# EasyEDA Pro project ProPrj_蓝牙遥控器.epro

# Schematic Schematic1
Board Name: Board1; Create Date: 2025-03-08; Page Name: P1; Project Name: 蓝牙遥控器; Schematic Name: Schematic1; Update Date: 2025-03-08; Company: 嘉立创EDA; Drawed: 李子晞; Page Size: A4; Version: V1.0
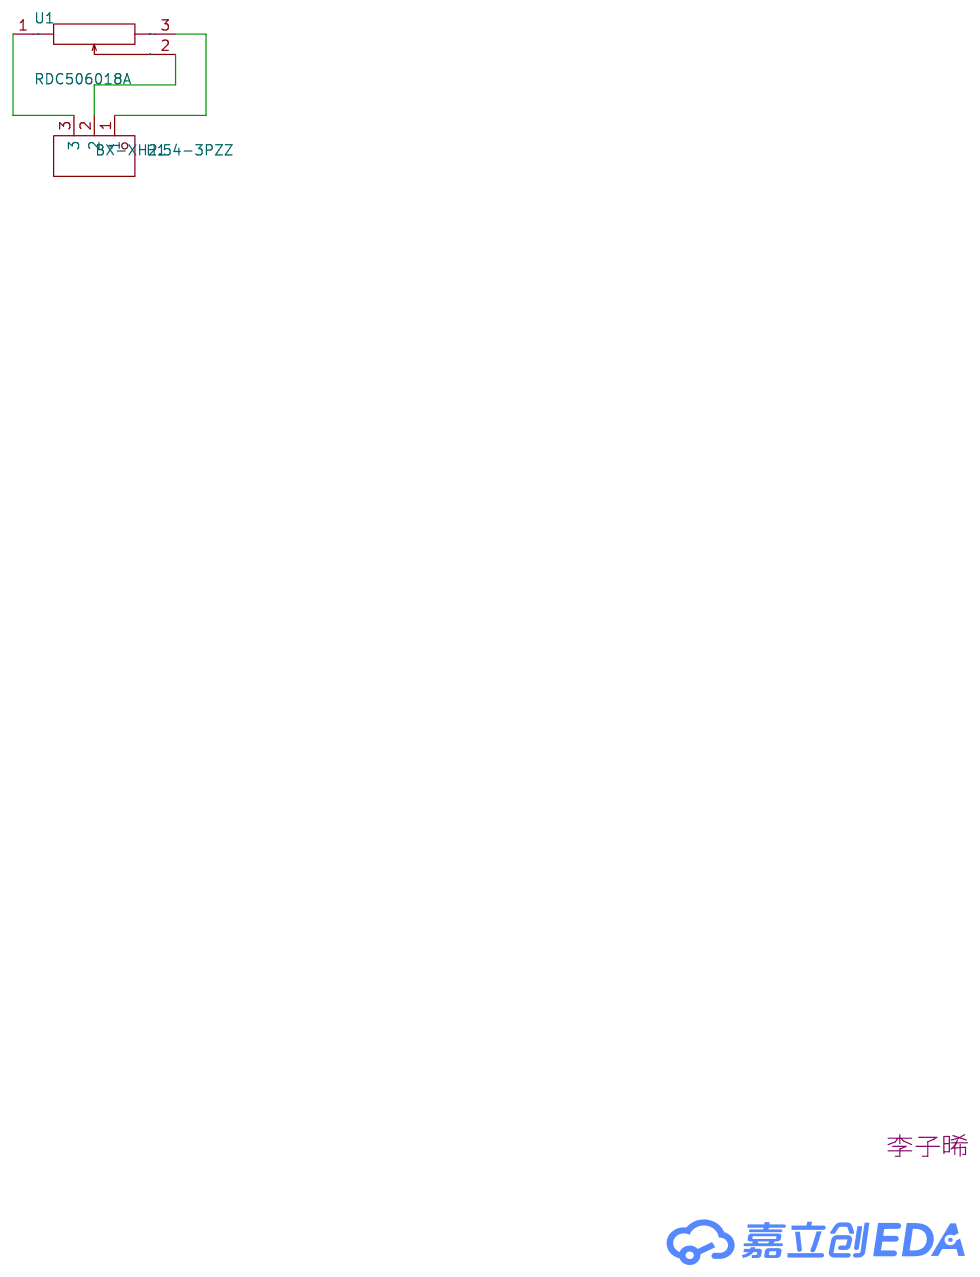
[diagram p0: schematic sheet]

## Parts
H1  BX-XH2.54-3PZZ  [CONN-TH_3P-P2.50_BX-XH2.54-3PZZ]
U1  RDC506018A  [SENSOR-SMD_RDC506018A]

## Library data of the parts
H1 = BX-XH2.54-3PZZ: 插针结构:1x3P;间距:2.5mm;安装方式:直插;参考系列:XH;总PIN数:3P;排数:1;每排PIN数:3;行距:-;额定电流:3A;触头材质:黄铜;触头镀层:锡;工作温度:-25℃~+85℃;; LCSC Part Name: 1x3P 间距:2.5mm 直插 系列:XH; Supplier Part: C18077834; Manufacturer: Bossie(博锡); Supplier Footprint: 插件,P=2.54mm; JLCPCB Part Class: Extended Part; Datasheet: https://atta.szlcsc.com/upload/public/pdf/source/20231017/BF89167887E1F965B2791D14EC788A09.pdf; Supplier: LCSC; Pins Structure: 1x3P; Pitch: 2.5mm; Mounting Type: 直插; Reference Series: XH; Number of Pins: 3P; Number of Rows: 1; Number of PINs Per Row: 3; Current Rating: 3A; Contact Material: 黄铜; Contact Plating: 锡; Operating Temperature: -25℃~+85℃; Voltage Rating: 250V; Plastic Material: PA66; Flame Retardant Rating: UL94V-0; Color: 白色; Z-Height of the Board: 7mm; X-Length of Bottom Edge on Board (Spacing Line): 10mm; Y-Width of Bottom Edge on Board: 5.9mm
U1 = RDC506018A: 额定电压5V DC,动作寿命100万次，总电阻值10kΩ，使用温度范围-40℃ to＋120℃，线性保证范围320°，线性±2%，可满足所有位置检测需要的旋转型传感器; Supplier Part: C388852; Manufacturer: ALPSALPINE(阿尔卑斯阿尔派); Supplier Footprint: SMD-4P,11x14.9mm; JLCPCB Part Class: 扩展库; Datasheet: https://atta.szlcsc.com/upload/public/pdf/source/20190429/C388852_87FA130E6FFB9C10E6A2BC328307F5A8.pdf; Supplier: LCSC

## Nets
$1N185: H1.3 U1.1(1T)
$1N190: H1.2 U1.2(2T)
$1N197: H1.1 U1.3(3T)

# Schematic Schematic2
Board Name: Board2; Create Date: 2025-03-08; Page Name: P1; Project Name: 蓝牙遥控器; Schematic Name: Schematic2; Update Date: 2025-03-09; Company: 嘉立创EDA; Drawed: 李子晞; Page Size: A4; Version: V1.0
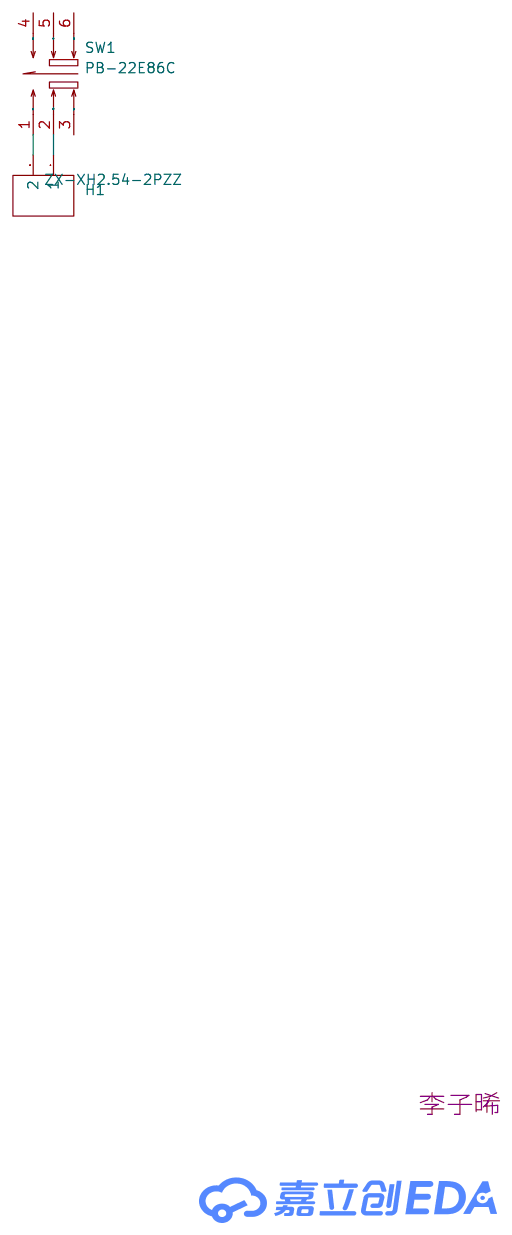
[diagram p1: schematic sheet]

## Parts
H1  ZX-XH2.54-2PZZ  [CONN-TH_2P-P2.50_HX25003-2A]
SW1  PB-22E86C  [SW-TH_6P-L8.45-W8.45-P2.50-LS5.5-BL]

## Library data of the parts
H1 = ZX-XH2.54-2PZZ: 插针结构:1x2P;间距:2.5mm;安装方式:直插;参考系列:XH;总PIN数:2P;排数:1;每排PIN数:2;行距:-;额定电流:3A;触头材质:黄铜;触头镀层:锡;工作温度范围:-25℃~+85℃;; LCSC Part Name: 1x2P 间距:2.5mm 直插 系列:XH; Supplier Part: C7429632; Manufacturer: Megastar(兆星); Supplier Footprint: 插件,P=2.5mm; JLCPCB Part Class: Extended Part; Datasheet: https://atta.szlcsc.com/upload/public/pdf/source/20230619/19BA6947230AA44A04D3EDD65E618FD0.pdf; Supplier: LCSC; Pins Structure: 1x2P; Pitch: 2.5mm; Mounting Type: 直插; Reference Series: XH; Number of Pins: 2P; Number of Rows: 1; Number of PINs Per Row: 2; Rated Current: 3A; Contact Material: 黄铜; Contact Plating: 锡; Operating Temperature: -25℃~+85℃; Rated Voltage (Max): 250V; Plastic Material: PA66; Flame Retardant Rating: UL94V-0; Color: 白色; Z-Height of the Board: 7mm; X-Length of Bottom Edge on Board (Spacing Line): 7.5mm; Y-Width of Bottom Edge on Board: 5.9mm
SW1 = PB-22E86C: 电路结构:双刀双掷;自锁/无锁:无锁;安装方式:直插;触点电流:500mA;额定电压 (AC):-;额定电压 (DC):30V;带灯:-;作用力:-;机械寿命:10万次;; LCSC Part Name: 8.5无锁按键开关; Supplier Part: C2848957; Manufacturer: G-Switch(品赞); Supplier Footprint: 插件; JLCPCB Part Class: 扩展库; Datasheet: https://atta.szlcsc.com/upload/public/pdf/source/20241029/FCE4AA5CBBB7A8CBC33D904DEAD1680D.pdf; Supplier: LCSC; Circuit: 双刀双掷; Self Lock / No Lock: 无锁; Actuator Style: 矩形柱塞; Mounting Style: 直插; Contact Current: 500mA; Voltage Rating (DC): 30V; Insulation Resistance: 100MΩ; Actuator/Cap Color: 黑色; Pin Style: PC引脚; Operating Temperature: -25℃~+65℃; Mechanical Life: 10万次

## Nets
$1N364: H1.2 SW1.1(BASE)
$1N367: H1.1 SW1.2(TERMINAL)

Not connected (* = marked no-connect by the designer): SW1 3(SPRING) 4(CONTACT) 5(STEM) 6(COVER)

# Schematic Schematic3
Board Name: 自定义控制器主控板; Create Date: 2025-03-10; Page Name: P1; Project Name: 蓝牙遥控器_开源; Schematic Name: Schematic3; Update Date: 2025-03-13; Company: 嘉立创EDA; Drawed: 李子晞; Page Size: A4; Version: V1.0
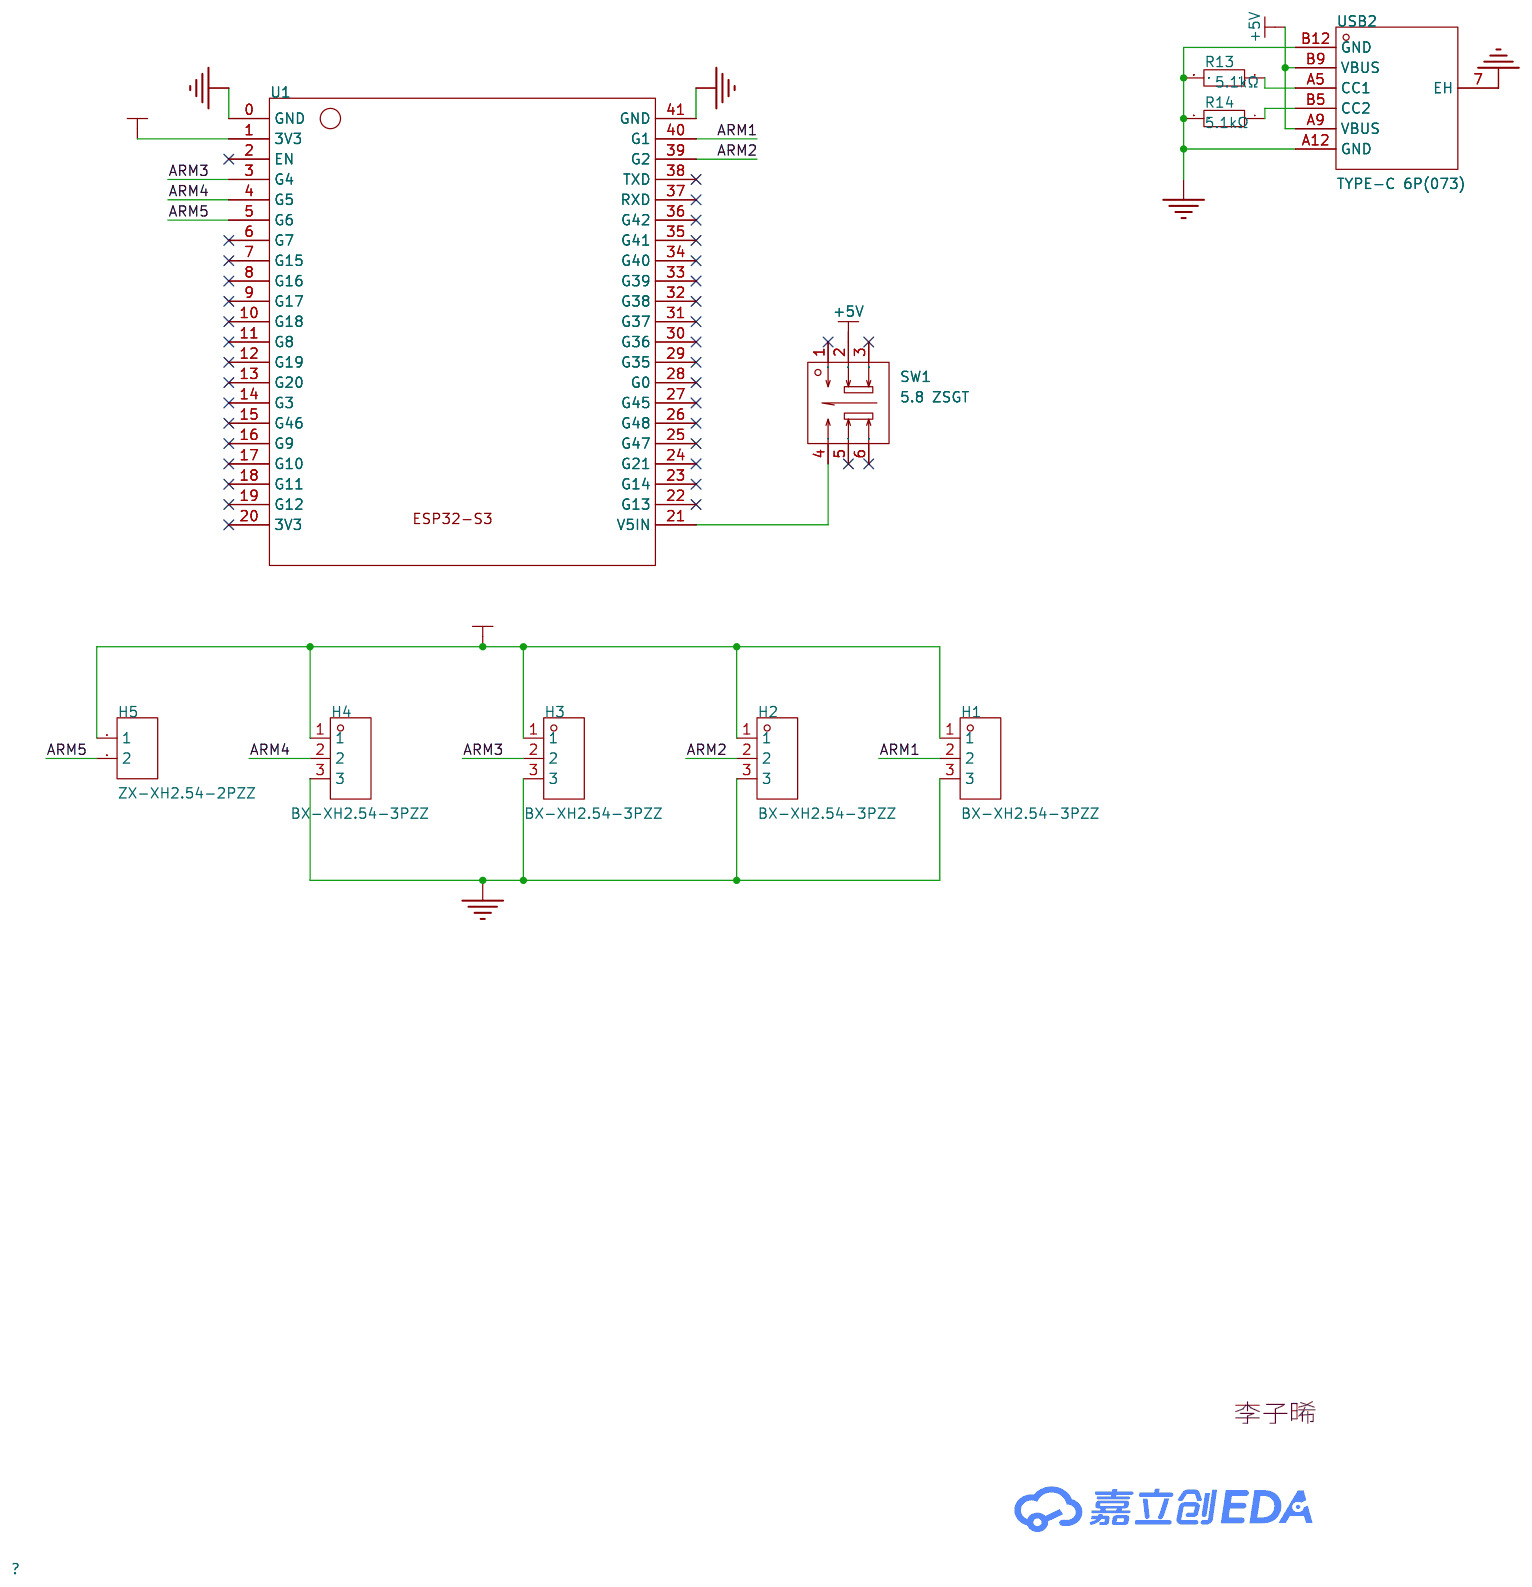
[diagram p2: schematic sheet]

## Parts
H1  BX-XH2.54-3PZZ  [CONN-TH_3P-P2.50_BX-XH2.54-3PZZ]
H2  BX-XH2.54-3PZZ  [CONN-TH_3P-P2.50_BX-XH2.54-3PZZ]
H3  BX-XH2.54-3PZZ  [CONN-TH_3P-P2.50_BX-XH2.54-3PZZ]
H4  BX-XH2.54-3PZZ  [CONN-TH_3P-P2.50_BX-XH2.54-3PZZ]
H5  ZX-XH2.54-2PZZ  [CONN-TH_2P-P2.50_HX25003-2A]
R13  5.1kΩ  [R0603]
R14  5.1kΩ  [R0603]
SW1  5.8 ZSGT  [SW-TH_5.8ZSGT]
U1  -  [ESP32-S3]
USB2  TYPE-C 6P(073)  [TYPE-C-SMD_TYPE-C-6P_5]

## Library data of the parts
H1-H4 = BX-XH2.54-3PZZ: 插针结构:1x3P;间距:2.5mm;安装方式:直插;参考系列:XH;总PIN数:3P;排数:1;每排PIN数:3;行距:-;额定电流:3A;触头材质:黄铜;触头镀层:锡;工作温度:-25℃~+85℃;; LCSC Part Name: 1x3P 间距:2.5mm 直插 系列:XH; Supplier Part: C18077834; Manufacturer: Bossie(博锡); Supplier Footprint: 插件,P=2.54mm; JLCPCB Part Class: Extended Part; Datasheet: https://atta.szlcsc.com/upload/public/pdf/source/20231017/BF89167887E1F965B2791D14EC788A09.pdf; Supplier: LCSC; Pins Structure: 1x3P; Pitch: 2.5mm; Mounting Type: 直插; Reference Series: XH; Number of Pins: 3P; Number of Rows: 1; Number of PINs Per Row: 3; Current Rating: 3A; Contact Material: 黄铜; Contact Plating: 锡; Operating Temperature: -25℃~+85℃; Voltage Rating: 250V; Plastic Material: PA66; Flame Retardant Rating: UL94V-0; Color: 白色; Z-Height of the Board: 7mm; X-Length of Bottom Edge on Board (Spacing Line): 10mm; Y-Width of Bottom Edge on Board: 5.9mm
H5 = ZX-XH2.54-2PZZ: 插针结构:1x2P;间距:2.5mm;安装方式:直插;参考系列:XH;总PIN数:2P;排数:1;每排PIN数:2;行距:-;额定电流:3A;触头材质:黄铜;触头镀层:锡;工作温度范围:-25℃~+85℃;; LCSC Part Name: 1x2P 间距:2.5mm 直插 系列:XH; Supplier Part: C7429632; Manufacturer: Megastar(兆星); Supplier Footprint: 插件,P=2.5mm; JLCPCB Part Class: Extended Part; Datasheet: https://atta.szlcsc.com/upload/public/pdf/source/20230619/19BA6947230AA44A04D3EDD65E618FD0.pdf; Supplier: LCSC; Pins Structure: 1x2P; Pitch: 2.5mm; Mounting Type: 直插; Reference Series: XH; Number of Pins: 2P; Number of Rows: 1; Number of PINs Per Row: 2; Rated Current: 3A; Contact Material: 黄铜; Contact Plating: 锡; Operating Temperature: -25℃~+85℃; Rated Voltage (Max): 250V; Plastic Material: PA66; Flame Retardant Rating: UL94V-0; Color: 白色; Z-Height of the Board: 7mm; X-Length of Bottom Edge on Board (Spacing Line): 7.5mm; Y-Width of Bottom Edge on Board: 5.9mm
R13 R14 = 0603WAF5101T5E: 电阻类型:厚膜电阻;阻值:5.1kΩ;精度:±1%;功率:100mW;最大工作电压:75V;温度系数:±100ppm/℃;; LCSC Part Name: 5.1kΩ ±1% 100mW 厚膜电阻; Supplier Part: C23186; Manufacturer: UNI-ROYAL(厚声); Supplier Footprint: 0603; JLCPCB Part Class: Basic Part; Datasheet: https://atta.szlcsc.com/upload/public/pdf/source/20200306/C422600_1E6D84923E4A46A82E41ADD87F860B5C.pdf; Supplier: LCSC; Type: 厚膜电阻; Tolerance: ±1%; Power(Watts): 100mW; Overload Voltage (Max): 75V; Temperature Coefficient: ±100ppm/℃; Operating Temperature Range: -55℃~+155℃
SW1 = 5.8 ZSGT: 电路结构:双刀双掷;自锁/无锁:自锁;安装方式:直插;触点电流:110mA;额定电压 (DC):30V;带灯:不带;作用力:1.5N;机械寿命:10万次;; LCSC Part Name: 5.8*5.8有头/高头 带锁/自锁开关 泡泡机开关; Supplier Part: C2681587; Manufacturer: SHOU HAN(首韩); Supplier Footprint: 插件; JLCPCB Part Class: 扩展库; Datasheet: https://atta.szlcsc.com/upload/public/pdf/source/20210107/C2681587_CDDDDA4A1C7AC9FEB01815B75893A6BA.pdf; Supplier: LCSC; Circuit: 双刀双掷; Self Lock / No Lock: 自锁; Actuator Style: 方形按钮; Mounting Style: 直插; Contact Current: 110mA; Voltage Rating (DC): 30V; Insulation Resistance: 100MΩ; Actuator/Cap Color: 白色; With Lamp: 不带; Pin Style: PC引脚; Operating Force: 1.5N; Operating Temperature: -10℃~+70℃; Mechanical Life: 10万次
U1 = ESP32S3: ESP32-S3 DevKitC-1-N16R8模块; Height: 14mm
USB2 = TYPE-C 6P(073): 连接器类型:Type-C;标准:USB 3.1;公母:母;安装方式:卧贴;触点数量:6P;端口数量:1;额定电流 - 电源:3A;工作温度范围:-25℃~+85℃;; LCSC Part Name: Type-C 母 卧贴; Supplier Part: C668623; Manufacturer: SHOU HAN(首韩); Supplier Footprint: SMD; JLCPCB Part Class: 扩展库; Datasheet: https://atta.szlcsc.com/upload/public/pdf/source/20200618/C668623_A4B260DED7AC1949BAC6AE39E9F4CD80.pdf; Supplier: LCSC; Connector Type: Type-C; Standard: USB 3.1; Gender: 母; Mounting Style: 卧贴; Number of Contacts: 6P; Number of Ports: 1; Current Rating - Power (Max): 3A; Operating Temperature Range: -25℃~+85℃; Rated Voltage (Max): 5V; Connect-Disconnect Life: 1万次; Core Colour: 黑色

## Nets
3V3: H1.1 H2.1 H3.1 H4.1 H5.1 U1.1(3V3)
+5V: SW1.2 USB2.A9(VBUS) USB2.B9(VBUS)
GND: H1.3 H2.3 H3.3 H4.3 R13.2 R14.2 U1.0(GND) U1.41(GND) USB2.7(EH) USB2.A12(GND) USB2.B12(GND)
ARM1: H1.2 U1.40(G1)
ARM2: H2.2 U1.39(G2)
ARM3: H3.2 U1.3(G4)
ARM4: H4.2 U1.4(G5)
ARM5: H5.2 U1.5(G6)
$1N2711: R13.1 USB2.A5(CC1)
$1N2712: R14.1 USB2.B5(CC2)
$1N2742: SW1.4 U1.21(V5IN)

Not connected (* = marked no-connect by the designer): SW1 1* 3* 5* 6*; U1 2(EN)* 6(G7)* 7(G15)* 8(G16)* 9(G17)* 10(G18)* 11(G8)* 12(G19)* 13(G20)* 14(G3)* 15(G46)* 16(G9)* 17(G10)* 18(G11)* 19(G12)* 20(3V3)* 22(G13)* 23(G14)* 24(G21)* 25(G47)* 26(G48)* 27(G45)* 28(G0)* 29(G35)* 30(G36)* 31(G37)* 32(G38)* 33(G39)* 34(G40)* 35(G41)* 36(G42)* 37(RXD)* 38(TXD)*

# Schematic Schematic4
Board Name: 摇杆控制板; Create Date: 2025-03-11; Page Name: P1; Project Name: 蓝牙遥控器; Schematic Name: Schematic4; Update Date: 2025-03-17; Company: 嘉立创EDA; Drawed: 李子晞; Page Size: A4; Version: V1.0
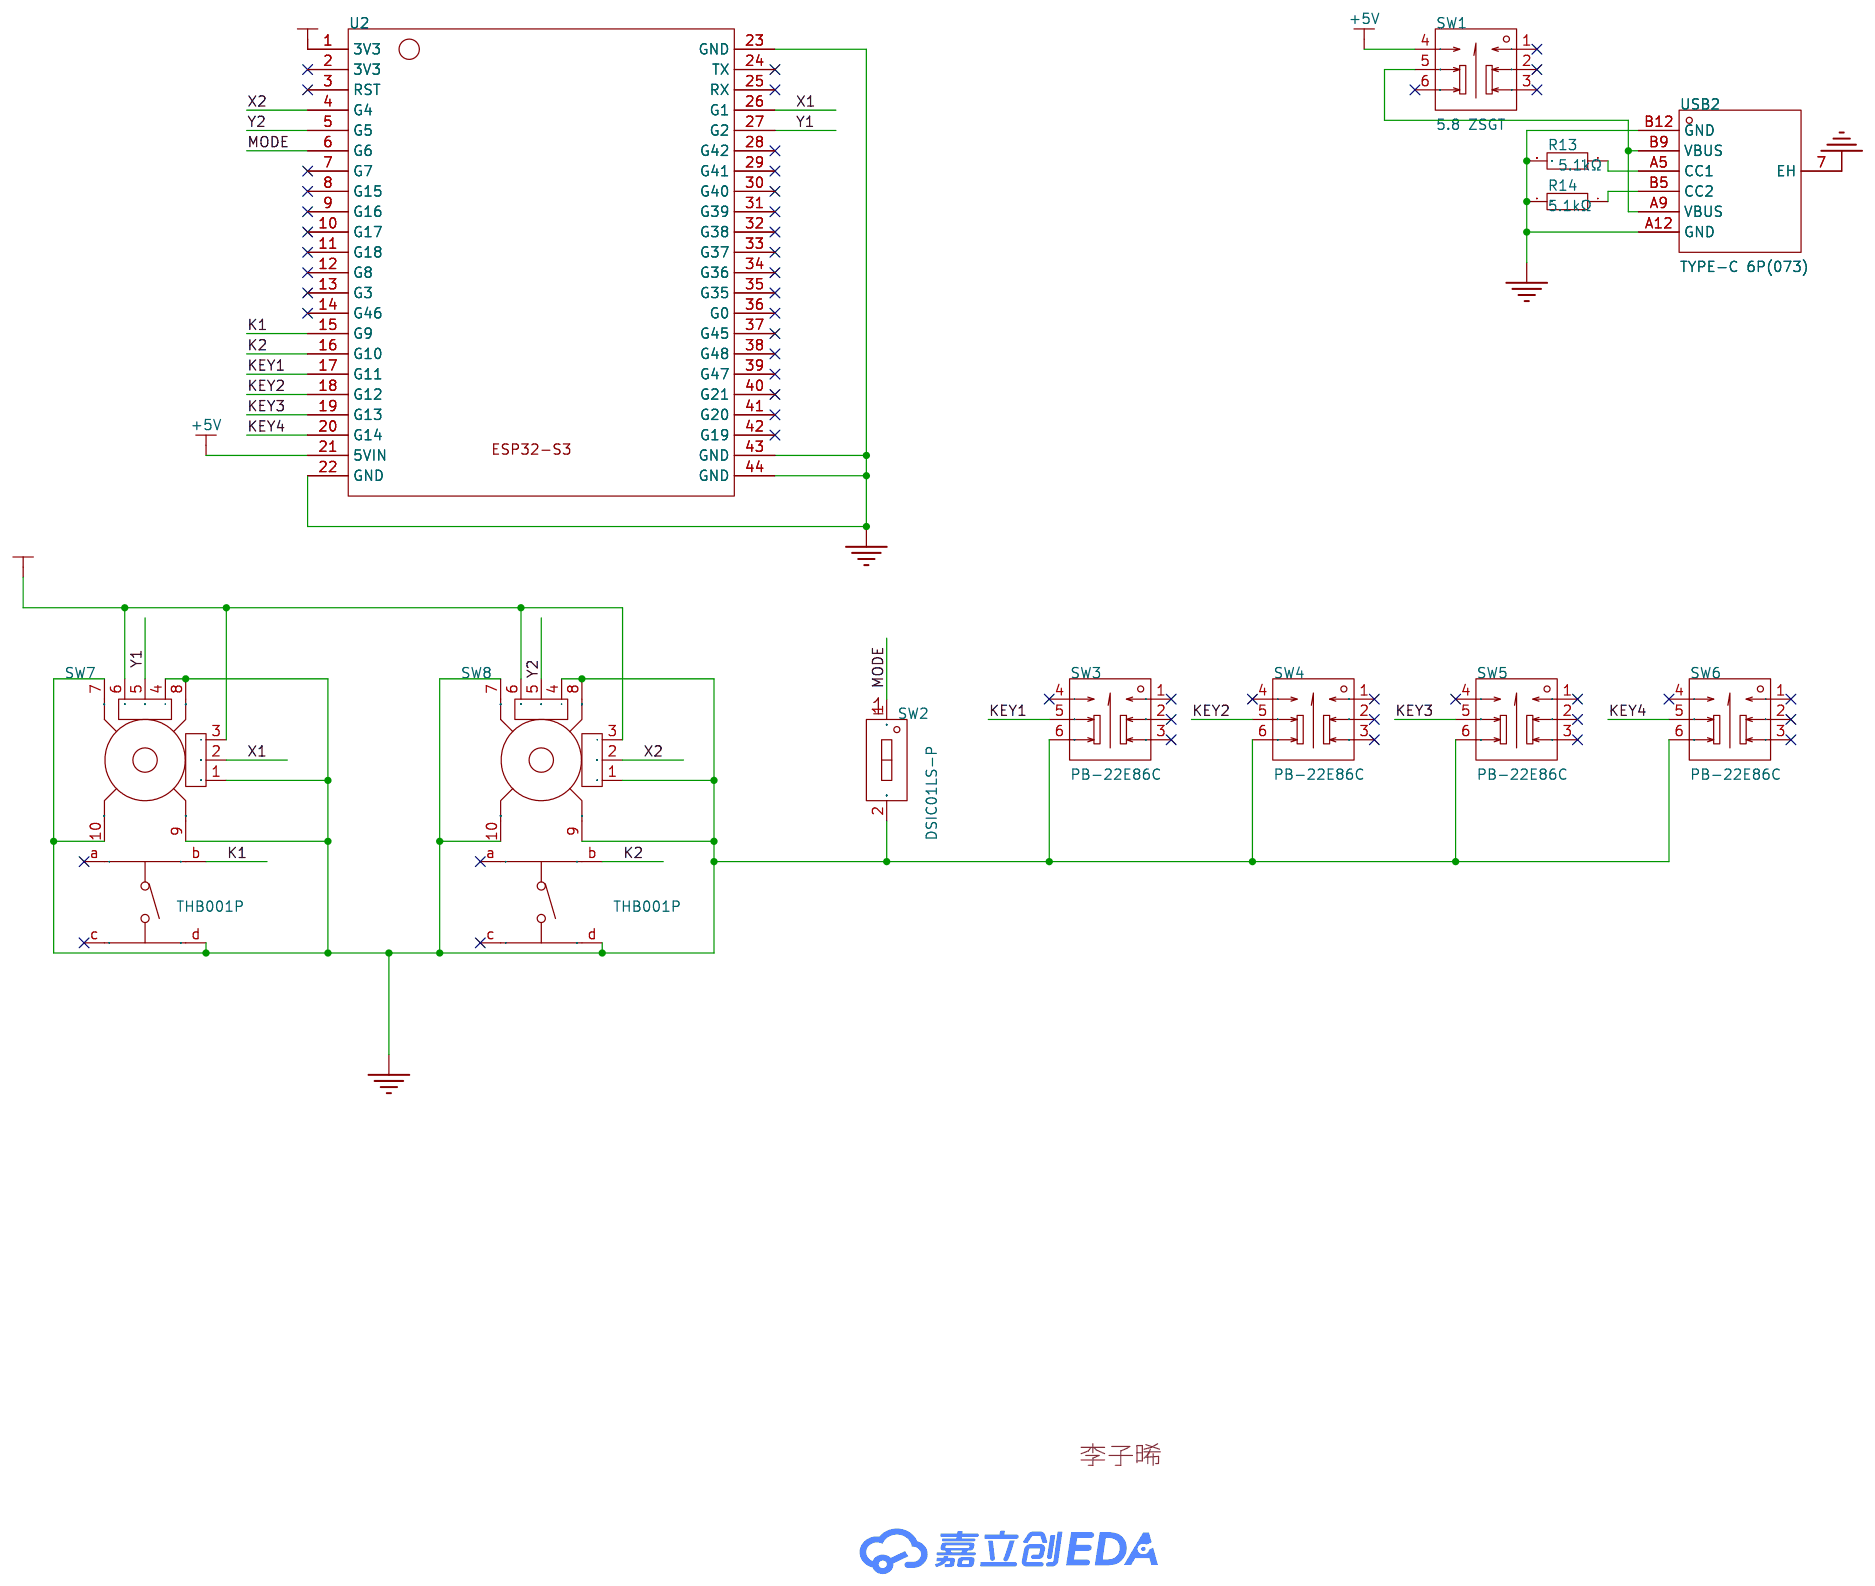
[diagram p3: schematic sheet]

## Parts
R13  5.1kΩ  [R0603]
R14  5.1kΩ  [R0603]
SW1  5.8 ZSGT  [SW-TH_5.8ZSGT]
SW2  DSIC01LS-P  [SW-SMD_2P-L3.5-W6.2-P2.54-LS9.8]
SW3  PB-22E86C  [SW-TH_6P-L8.45-W8.45-P2.50-LS5.5-BL]
SW4  PB-22E86C  [SW-TH_6P-L8.45-W8.45-P2.50-LS5.5-BL]
SW5  PB-22E86C  [SW-TH_6P-L8.45-W8.45-P2.50-LS5.5-BL]
SW6  PB-22E86C  [SW-TH_6P-L8.45-W8.45-P2.50-LS5.5-BL]
SW7  THB001P  [SW-TH_THB001P]
SW8  THB001P  [SW-TH_THB001P]
U2  -  [ESP32S3-R店]
USB2  TYPE-C 6P(073)  [TYPE-C-SMD_TYPE-C-6P_5]

## Library data of the parts
R13 R14 = 0603WAF5101T5E: 电阻类型:厚膜电阻;阻值:5.1kΩ;精度:±1%;功率:100mW;最大工作电压:75V;温度系数:±100ppm/℃;; LCSC Part Name: 5.1kΩ ±1% 100mW 厚膜电阻; Supplier Part: C23186; Manufacturer: UNI-ROYAL(厚声); Supplier Footprint: 0603; JLCPCB Part Class: Basic Part; Datasheet: https://atta.szlcsc.com/upload/public/pdf/source/20200306/C422600_1E6D84923E4A46A82E41ADD87F860B5C.pdf; Supplier: LCSC; Type: 厚膜电阻; Tolerance: ±1%; Power(Watts): 100mW; Overload Voltage (Max): 75V; Temperature Coefficient: ±100ppm/℃; Operating Temperature Range: -55℃~+155℃
SW1 = 5.8 ZSGT: 电路结构:双刀双掷;自锁/无锁:自锁;安装方式:直插;触点电流:110mA;额定电压 (DC):30V;带灯:不带;作用力:1.5N;机械寿命:10万次;; LCSC Part Name: 5.8*5.8有头/高头 带锁/自锁开关 泡泡机开关; Supplier Part: C2681587; Manufacturer: SHOU HAN(首韩); Supplier Footprint: 插件; JLCPCB Part Class: 扩展库; Datasheet: https://atta.szlcsc.com/upload/public/pdf/source/20210107/C2681587_CDDDDA4A1C7AC9FEB01815B75893A6BA.pdf; Supplier: LCSC; Circuit: 双刀双掷; Self Lock / No Lock: 自锁; Actuator Style: 方形按钮; Mounting Style: 直插; Contact Current: 110mA; Voltage Rating (DC): 30V; Insulation Resistance: 100MΩ; Actuator/Cap Color: 白色; With Lamp: 不带; Pin Style: PC引脚; Operating Force: 1.5N; Operating Temperature: -10℃~+70℃; Mechanical Life: 10万次
SW2 = DSIC01LS-P: 类型:平拨,凸起式;电路结构:单刀单掷;开关位数:1位;额定电流:25mA;额定电压:24V;使用寿命:3千次;颜色:黑色;; LCSC Part Name: 平拨,凸起式 1位拨码开关; Supplier Part: C600988; Manufacturer: XKB Connectivity(中国星坤); Supplier Footprint: SMD,3.5x6.2mm; JLCPCB Part Class: 扩展库; Datasheet: https://atta.szlcsc.com/upload/public/pdf/source/20181029/C319044_89B44386426E378AA9595AB22F0589AA.pdf; Supplier: LCSC; Type: 平拨,凸起式; Circuit: 单刀单掷; Number of Positions: 1位; Pin Style: 鸥翼型; Current Rating: 25mA; Voltage Rating: 24V; Operating Temperature: -20℃~+70℃; Operating Life: 3千次; Color: 黑色
SW3-SW6 = PB-22E86C: 电路结构:双刀双掷;自锁/无锁:无锁;安装方式:直插;触点电流:500mA;额定电压 (AC):-;额定电压 (DC):30V;带灯:-;作用力:-;机械寿命:10万次;; LCSC Part Name: 8.5无锁按键开关; Supplier Part: C2848957; Manufacturer: G-Switch(品赞); Supplier Footprint: 插件; JLCPCB Part Class: Extended Part; Datasheet: https://atta.szlcsc.com/upload/public/pdf/source/20241029/FCE4AA5CBBB7A8CBC33D904DEAD1680D.pdf; Supplier: LCSC; Circuit: 双刀双掷; Self Lock / No Lock: 无锁; Actuator Style: 矩形柱塞; Mounting Style: 直插; Contact Current: 500mA; Voltage Rating (DC): 30V; Insulation Resistance: 100MΩ; Actuator/Cap Color: 黑色; Pin Style: PC引脚; Operating Temperature: -25℃~+65℃; Mechanical Life: 10万次
SW7 SW8 = THB001P: 带有多功能, 高质量的双轴杠杆和集成的中心选择开关 适用于航模玩具遥控器电位器、3D摇杆PS4手柄游戏机、无人机摇杆电位器、工业控制器; LCSC Part Name: 微型指拨摇杆开关; Supplier Part: C2685355; Manufacturer: C&K; Supplier Footprint: 插件-14P,17x21mm; JLCPCB Part Class: 扩展库; Datasheet: https://atta.szlcsc.com/upload/public/pdf/source/20210114/C2685355_98E98C84804317E8B305B6FAD3A93D12.pdf; Supplier: LCSC
U2 = ESP32S3-R店: ESP32S3-N16R8，来自R店
USB2 = TYPE-C 6P(073): 连接器类型:Type-C;标准:USB 3.1;公母:母;安装方式:卧贴;触点数量:6P;端口数量:1;额定电流 - 电源:3A;工作温度范围:-25℃~+85℃;; LCSC Part Name: Type-C 母 卧贴; Supplier Part: C668623; Manufacturer: SHOU HAN(首韩); Supplier Footprint: SMD; JLCPCB Part Class: 扩展库; Datasheet: https://atta.szlcsc.com/upload/public/pdf/source/20200618/C668623_A4B260DED7AC1949BAC6AE39E9F4CD80.pdf; Supplier: LCSC; Connector Type: Type-C; Standard: USB 3.1; Gender: 母; Mounting Style: 卧贴; Number of Contacts: 6P; Number of Ports: 1; Current Rating - Power (Max): 3A; Operating Temperature Range: -25℃~+85℃; Rated Voltage (Max): 5V; Connect-Disconnect Life: 1万次; Core Colour: 黑色

## Nets
3V3: SW7.3(A) SW7.6(B) SW8.3(A) SW8.6(B) U2.1(3V3)
+5V: SW1.4 U2.21(5VIN)
GND: R13.2 R14.2 SW2.2(PIN2) SW3.6 SW4.6 SW5.6 SW6.6 SW7.1(B) SW7.4(A) SW7.7(GND) SW7.8(GND) SW7.9(GND) SW7.10(GND) SW7.d SW8.1(B) SW8.4(A) SW8.7(GND) SW8.8(GND) SW8.9(GND) SW8.10(GND) SW8.d U2.22(GND) U2.23(GND) U2.43(GND) U2.44(GND) USB2.7(EH) USB2.A12(GND) USB2.B12(GND)
K1: SW7.b U2.15(G9)
K2: SW8.b U2.16(G10)
KEY1: SW3.5 U2.17(G11)
KEY2: SW4.5 U2.18(G12)
KEY3: SW5.5 U2.19(G13)
KEY4: SW6.5 U2.20(G14)
MODE: SW2.1(PIN1) U2.6(G6)
X1: SW7.2(DTA) U2.26(G1)
X2: SW8.2(DTA) U2.4(G4)
Y1: SW7.5(DTA) U2.27(G2)
Y2: SW8.5(DTA) U2.5(G5)
$1N655: R13.1 USB2.A5(CC1)
$1N656: R14.1 USB2.B5(CC2)
$1N657: SW1.5 USB2.A9(VBUS) USB2.B9(VBUS)

Not connected (* = marked no-connect by the designer): SW1 1* 2* 3* 6*; SW3 1* 2* 3* 4*; SW4 1* 2* 3* 4*; SW5 1* 2* 3* 4*; SW6 1* 2* 3* 4*; SW7 a* c*; SW8 a* c*; U2 2(3V3)* 3(RST)* 7(G7)* 8(G15)* 9(G16)* 10(G17)* 11(G18)* 12(G8)* 13(G3)* 14(G46)* 24(TX)* 25(RX)* 28(G42)* 29(G41)* 30(G40)* 31(G39)* 32(G38)* 33(G37)* 34(G36)* 35(G35)* 36(G0)* 37(G45)* 38(G48)* 39(G47)* 40(G21)* 41(G20)* 42(G19)*

# Board PCB1
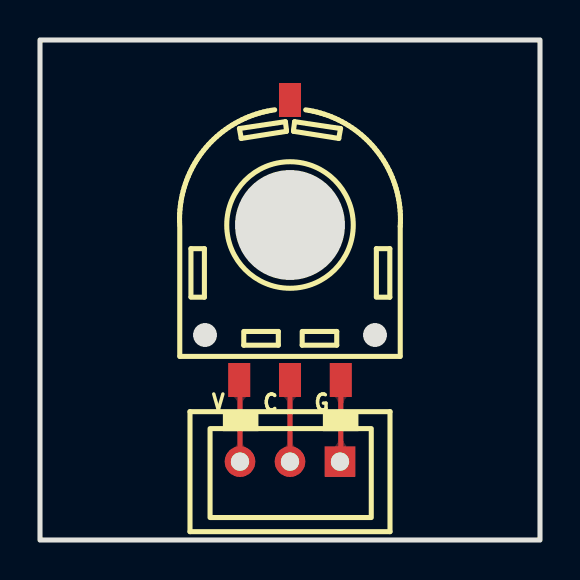
[diagram p4: board, top side]
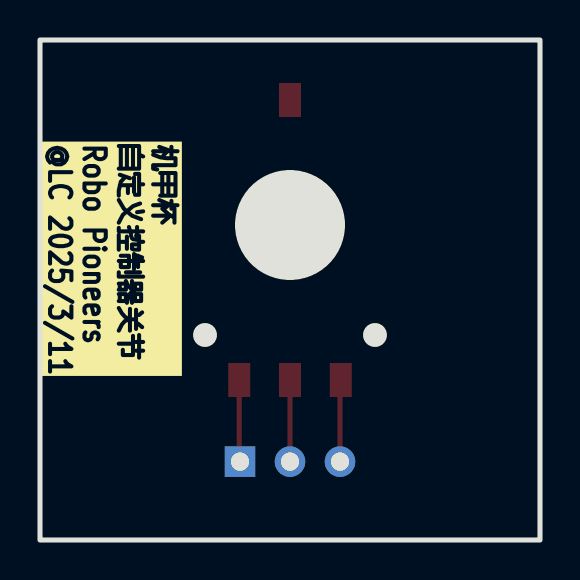
[diagram p5: board, bottom side, seen from below]

Outline 25 x 25 mm; copper layers: Top Layer, Bottom Layer. Coordinates in mm from the lower left corner of the outline.
Outline path: rectangle 0,25 25,0
Stack: Top Layer 0.035mm / Dielectric1 1.51mm FR4 er 4.5 / Bottom Layer 0.035mm

## Design rules (mm)
template: JLCPCB Capability(Two Layers Board)
spacing copperThickness1oz (default): track to track 0.102, other pairs 0.152 to 0.3
spacing copperThickness2oz: track to track 0.203, other pairs 0.152 to 0.3
track width copperThickness1oz (default): min 0.127, default 0.254, max 2.54
track width copperThickness2oz: min 0.203, default 0.254, max 2.54
differential pair differentialPair (default): width min 0.127, default 0.254, max 2.54; gap min 0.152, default 0.152
via viaSize (default): diameter min 0.5, default 0.61, max 10; hole min 0.3, default 0.305, max 6.3

## Placement (name value [footprint] x y rotation side)
H1  BX-XH2.54-3PZZ  [CONN-TH_3P-P2.50_BX-XH2.54-3PZZ]  12.5 3.92 180 top
U1  RDC506018A  [SENSOR-SMD_RDC506018A]  12.5 15 0 top

## Footprints (pads in the part's own frame, mm; a bottom-side part is the same pattern mirrored in y, then rotated)
CONN-TH_3P-P2.50_BX-XH2.54-3PZZ
  rect 1.524x1.524 hole 0.914: 1(-2.5,0)
  round 1.524 hole 0.914: 2(0,0) 3(2.5,0)
SENSOR-SMD_RDC506018A
  rect 1.1x1.7 smd: 1(-2.54,-7) 2(0,-7) 3(2.54,-7) 4(0,7)

## Nets
As in the schematic.

Pads without a net: U1 4

## Routing (per net, layer and track width the routed paths; a pad name or vN(x,y) marks a point on that pad's centre or on a via; arc(x,y) is an arc through that point)
$1N185: length 4.1
  Top Layer w0.254: H1.3 10,8 U1.1
$1N190: length 4.3
  Top Layer w0.254: U1.2 H1.2 12.7,3.92
$1N197: length 4.1
  Top Layer w0.254: H1.1 15.04,3.92 U1.3

Small or netless copper shapes (teardrops, artwork), in the pictures only: 6 on Top Layer

## Text on the board
Bottom Silkscreen Layer: 机甲杯 / 自定义控制器关节 / Robo Pioneers / @LC 2025/3/11
Top Silkscreen Layer: V | C | G

# Board PCB2
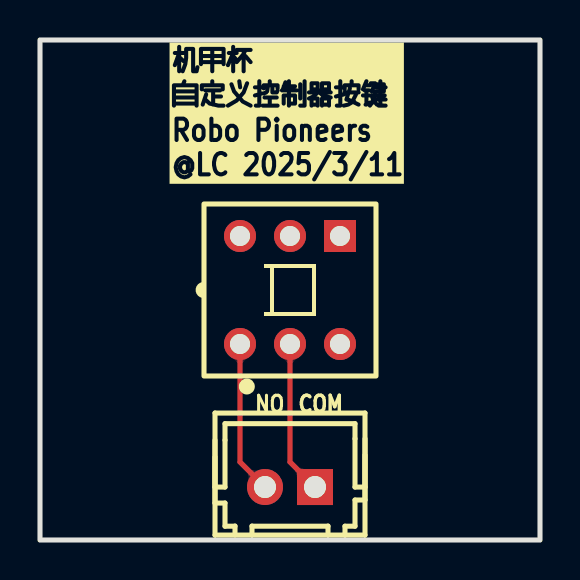
[diagram p6: board, top side]
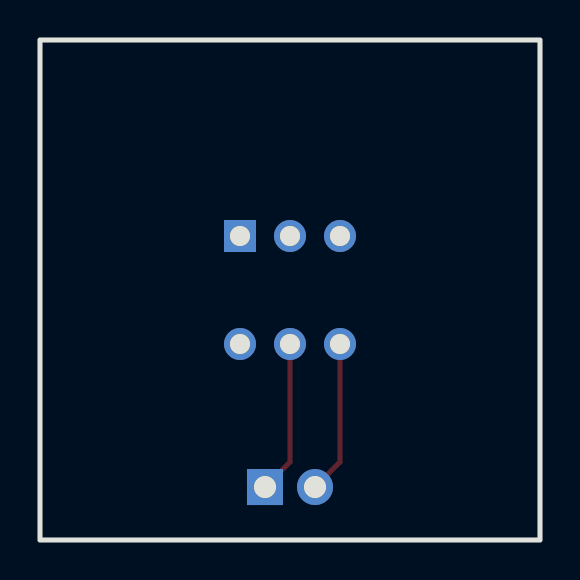
[diagram p7: board, bottom side, seen from below]

Outline 25 x 25 mm; copper layers: Top Layer, Bottom Layer. Coordinates in mm from the lower left corner of the outline.
Outline path: rectangle 0,25 25,0
Stack: Top Layer 0.035mm / Dielectric1 1.51mm FR4 er 4.5 / Bottom Layer 0.035mm

## Design rules (mm)
template: JLCPCB Capability(Two Layers Board)
spacing copperThickness1oz (default): track to track 0.102, other pairs 0.152 to 0.3
spacing copperThickness2oz: track to track 0.203, other pairs 0.152 to 0.3
track width copperThickness1oz (default): min 0.127, default 0.254, max 2.54
track width copperThickness2oz: min 0.203, default 0.254, max 2.54
differential pair differentialPair (default): width min 0.127, default 0.254, max 2.54; gap min 0.152, default 0.152
via viaSize (default): diameter min 0.5, default 0.61, max 10; hole min 0.3, default 0.305, max 6.3

## Placement (name value [footprint] x y rotation side)
H1  ZX-XH2.54-2PZZ  [CONN-TH_2P-P2.50_HX25003-2A]  12.5 2.65 180 top
SW1  PB-22E86C  [SW-TH_6P-L8.45-W8.45-P2.50-LS5.5-BL]  12.5 12.5 180 top

## Footprints (pads in the part's own frame, mm; a bottom-side part is the same pattern mirrored in y, then rotated)
CONN-TH_2P-P2.50_HX25003-2A
  rect 1.8x1.8 hole 1.1: 1(-1.25,0)
  round 1.8 hole 1.1: 2(1.25,0)
SW-TH_6P-L8.45-W8.45-P2.50-LS5.5-BL
  round 1.6 hole 1: 1(2.5,2.7) 2(0,2.7) 3(-2.5,2.7) 4(2.5,-2.7) 5(0,-2.7)
  rect 1.6x1.6 hole 1: 6(-2.5,-2.7)

## Nets
As in the schematic.

Pads without a net: SW1 3 4 5 6

## Routing (per net, layer and track width the routed paths; a pad name or vN(x,y) marks a point on that pad's centre or on a via; arc(x,y) is an arc through that point)
$1N364: length 7.7
  Top Layer w0.254: SW1.1 10,3.9 H1.2
$1N367: length 7.7
  Top Layer w0.254: SW1.2 12.5,3.9 H1.1

Small or netless copper shapes (teardrops, artwork), in the pictures only: 4 on Top Layer

## Text on the board
Top Silkscreen Layer: NO | COM | 机甲杯 / 自定义控制器按键 / Robo Pioneers / @LC 2025/3/11

# Board PCB3
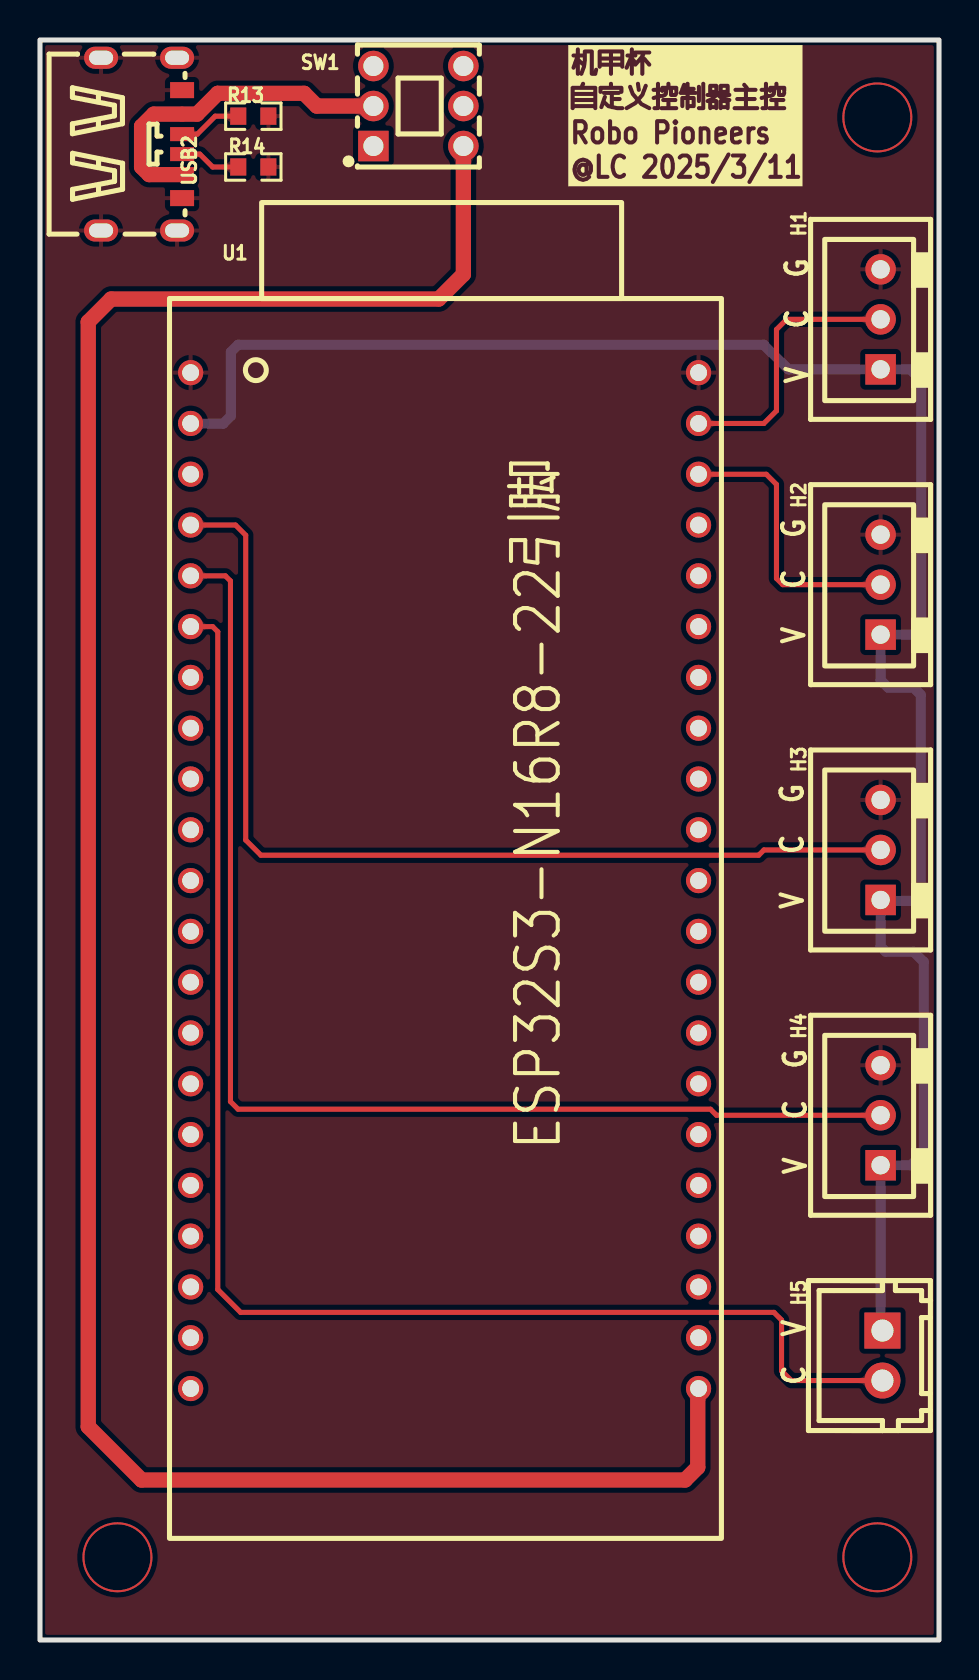
[diagram p8: board, top side]
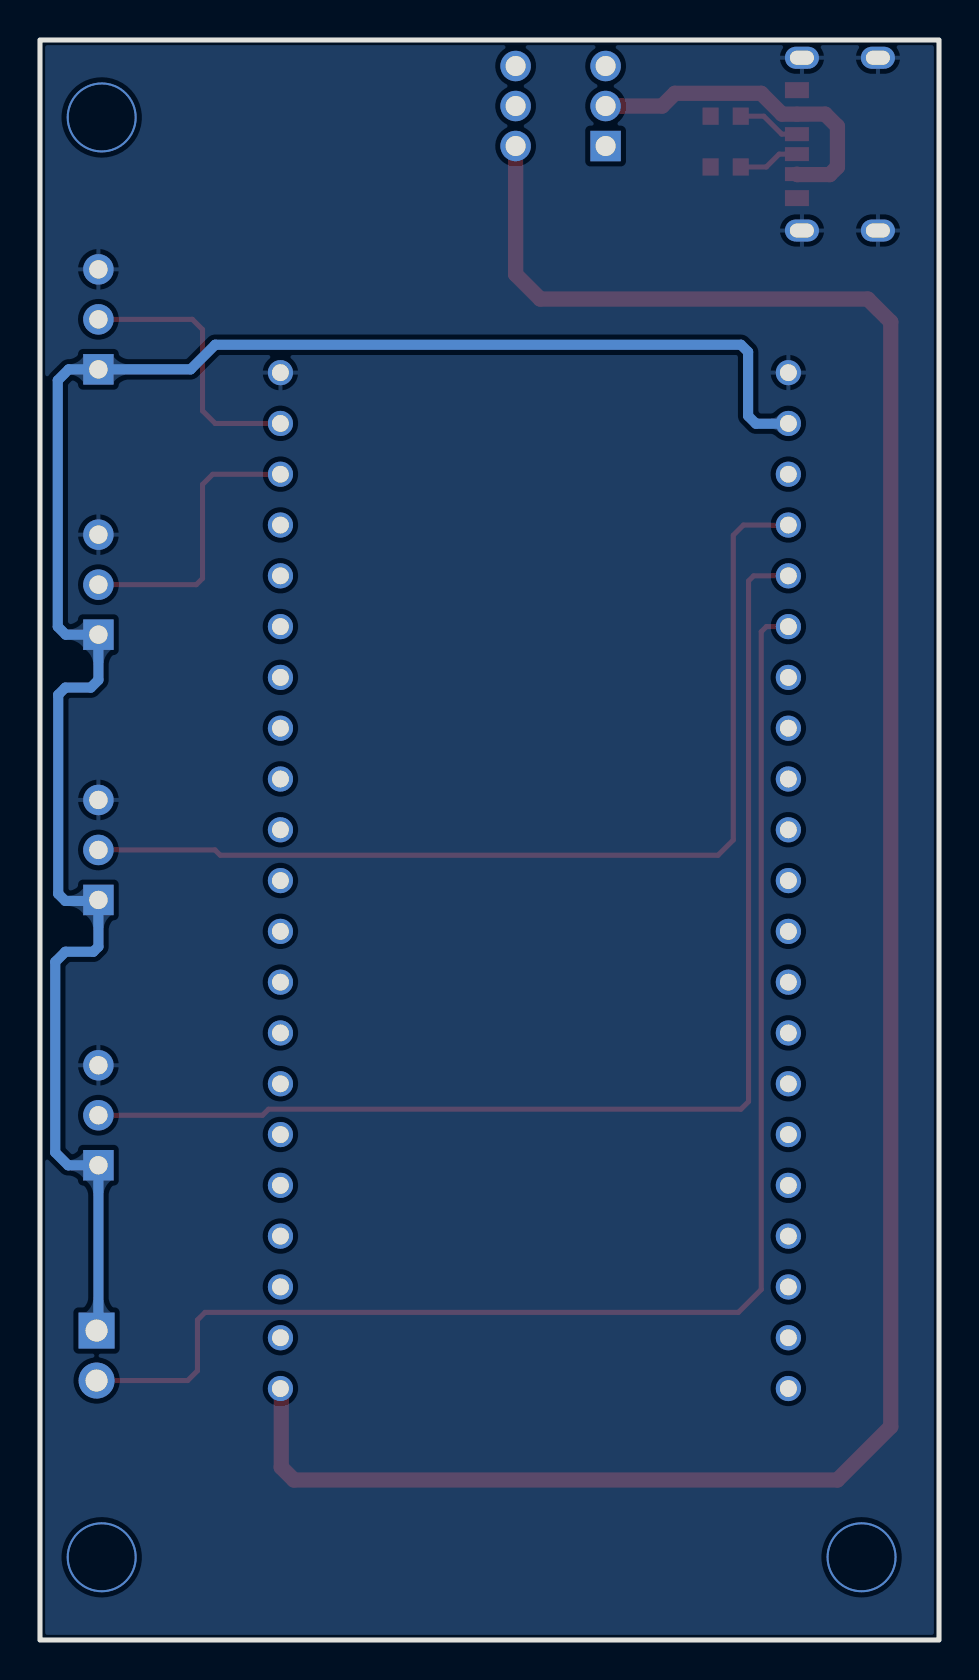
[diagram p9: board, bottom side, seen from below]

Outline 44.96 x 80.01 mm; copper layers: Top Layer, Bottom Layer. Coordinates in mm from the lower left corner of the outline.
Outline path: rectangle 0,80.01 44.96,0
Stack: Top Layer 0.035mm / Dielectric1 1.51mm FR4 er 4.5 / Bottom Layer 0.035mm

## Design rules (mm)
template: JLCPCB Capability(Two Layers Board)
spacing copperThickness1oz (default): track to track 0.102, other pairs 0.152 to 0.3
spacing copperThickness2oz: track to track 0.203, other pairs 0.152 to 0.3
track width copperThickness1oz (default): min 0.127, default 0.254, max 2.54
track width copperThickness2oz: min 0.203, default 0.254, max 2.54
differential pair differentialPair (default): width min 0.127, default 0.254, max 2.54; gap min 0.152, default 0.152
via viaSize (default): diameter min 0.5, default 0.61, max 10; hole min 0.3, default 0.305, max 6.3

## Placement (name value [footprint] x y rotation side)
H1  BX-XH2.54-3PZZ  [CONN-TH_3P-P2.50_BX-XH2.54-3PZZ]  42.04 66.04 90 top
H2  BX-XH2.54-3PZZ  [CONN-TH_3P-P2.50_BX-XH2.54-3PZZ]  42.04 52.77 90 top
H3  BX-XH2.54-3PZZ  [CONN-TH_3P-P2.50_BX-XH2.54-3PZZ]  42.04 39.51 90 top
H4  BX-XH2.54-3PZZ  [CONN-TH_3P-P2.50_BX-XH2.54-3PZZ]  42.04 26.24 90 top
H5  ZX-XH2.54-2PZZ  [CONN-TH_2P-P2.50_HX25003-2A]  42.13 14.22 270 top
R13  5.1kΩ  [R0603]  10.67 76.2 0 top
R14  5.1kΩ  [R0603]  10.67 73.66 0 top
SW1  5.8 ZSGT  [SW-TH_5.8ZSGT]  18.92 76.71 270 top
U1  -  [ESP32-S3]  7.62 13.59 0 top
USB2  TYPE-C 6P(073)  [TYPE-C-SMD_TYPE-C-6P_5]  5.08 74.8 270 top

## Footprints (pads in the part's own frame, mm; a bottom-side part is the same pattern mirrored in y, then rotated)
CONN-TH_2P-P2.50_HX25003-2A
  rect 1.8x1.8 hole 1.1: 1(-1.25,0)
  round 1.8 hole 1.1: 2(1.25,0)
CONN-TH_3P-P2.50_BX-XH2.54-3PZZ
  rect 1.524x1.524 hole 0.914: 1(-2.5,0)
  round 1.524 hole 0.914: 2(0,0) 3(2.5,0)
ESP32-S3
  round 1.26 hole 0.84: 0(-0.086,49.786) 1(-0.086,47.246) 2(-0.086,44.706) 3(-0.086,42.166) 4(-0.086,39.626) 5(-0.086,37.086) 6(-0.086,34.546) 7(-0.086,32.006) 8(-0.086,29.466) 9(-0.086,26.926) 10(-0.086,24.386) 11(-0.086,21.846) 12(-0.086,19.306) 13(-0.086,16.766) 14(-0.086,14.226) 15(-0.086,11.686) 16(-0.086,9.146) 17(-0.086,6.606) 18(-0.086,4.066) 19(-0.086,1.526) 20(-0.086,-1.014) 21(25.314,-1.014) 22(25.314,1.526) 23(25.314,4.066) 24(25.314,6.606) 25(25.314,9.146) 26(25.314,11.686) 27(25.314,14.226) 28(25.314,16.766) 29(25.314,19.306) 30(25.314,21.846) 31(25.314,24.386) 32(25.314,26.926) 33(25.314,29.466) 34(25.314,32.006) 35(25.314,34.546) 36(25.314,37.086) 37(25.314,39.626) 38(25.314,42.166) 39(25.314,44.706) 40(25.314,47.246) 41(25.314,49.786)
R0603
  rect 0.806x0.864 smd: 1(-0.753,0) 2(0.753,0)
SW-TH_5.8ZSGT
  rect 1.524x1.524 hole 1: 1(2,-2.25)
  round 1.524 hole 1: 2(0,-2.25) 3(-2,-2.25) 4(2,2.25) 5(0,2.25) 6(-2,2.25)
TYPE-C-SMD_TYPE-C-6P_5
  oval 1.1x1.7 hole 0.7x1.2: 7(-4.32,1.775) 7(-4.32,-2.025) 7(4.32,1.775) 7(4.32,-2.025)
  rect 0.7x1.2 smd: A5(-0.5,2.025) A9(1.5,2.025) B5(0.5,2.025) B9(-1.5,2.025)
  rect 0.8x1.2 smd: A12(2.7,2.025) B12(-2.7,2.025)

## Nets
As in the schematic.

Pads without a net: SW1 1 3 5 6; U1 2 6 7 8 9 10 11 12 13 14 15 16 17 18 19 20 22 23 24 25 26 27 28 29 30 31 32 33 34 35 36 37 38

## Via types
v1: diameter 3.5, hole 3.3, Top Layer to Bottom Layer, 3 vias

## Routing (per net, layer and track width the routed paths; a pad name or vN(x,y) marks a point on that pad's centre or on a via; arc(x,y) is an arc through that point)
3V3: length 97.1
  Bottom Layer w0.508: H5.1 42.04,15.57 H4.1 43.55,23.74 44.2,24.38 44.2,33.91 43.69,34.42 42.29,34.42 42.04,34.67 H3.1 42.09,36.96 43.69,36.96 44.05,37.32 44.05,47.27 43.69,47.62 42.42,47.62 42.04,48.01 H2.1 43.67,50.27 44.07,50.67 44.07,62.99 43.52,63.54 H1.1 37.42,63.54 36.19,64.77 9.91,64.77 9.55,64.41 9.55,61.21 9.16,60.82 7.55,60.82 U1.1
+5V: length 16.8
  Top Layer w0.762: SW1.2 13.84,76.71 13.21,77.34 8.89,77.34 7.85,76.3 USB2.B9 5.69,76.3 5.08,75.69 5.08,73.66 5.46,73.28 7.08,73.28 USB2.A9
(no net):
  vias: v1(3.87,4.14) v1(41.87,76.14) v1(41.87,4.14)
ARM1: length 13.6
  Top Layer w0.254: H1.2 37.34,66.04 36.83,65.53 36.83,61.47 36.19,60.83 32.94,60.83 U1.40
ARM2: length 14.1
  Top Layer w0.254: H2.2 37.14,52.77 36.83,53.09 36.83,57.78 36.32,58.29 32.94,58.29 U1.39
ARM3: length 50.4
  Top Layer w0.254: U1.3 9.78,55.75 10.29,55.25 10.29,40 11.05,39.24 35.94,39.24 36.21,39.51 H3.2
ARM4: length 60.9
  Top Layer w0.254: H4.2 33.83,26.24 33.53,26.54 9.91,26.54 9.52,26.92 9.52,52.96 9.27,53.21 7.54,53.21 U1.4
ARM5: length 71
  Top Layer w0.254: H5.2 37.57,12.97 37.08,13.46 37.08,16 36.7,16.38 10.03,16.38 8.89,17.53 8.89,50.42 8.63,50.67 U1.5
$1N2711: length 3.2
  Top Layer w0.254: R13.1 8.76,76.2 7.87,75.3 USB2.A5
$1N2712: length 3.1
  Top Layer w0.254: R14.1 8.64,73.66 7.99,74.3 USB2.B5
$1N2742: length 117.2
  Top Layer w0.762: U1.21 32.89,12.53 32.89,8.64 32.26,8 5.08,8 2.41,10.67 2.41,65.91 3.56,67.06 19.94,67.06 21.17,68.29 SW1.4

## Copper pours and planes (outline as drawn; the poured copper is in the pictures)
GND on Top Layer: -10.29,88.27 79.38,88.27 79.38,-11.43 -10.29,-11.43
GND on Bottom Layer: -9.4,87.5 82.3,87.5 82.3,-10.54 -9.4,-10.54

Small or netless copper shapes (teardrops, artwork), in the pictures only: 17 on Top Layer, 10 on Bottom Layer

## Text on the board
Top Silkscreen Layer: G | C | V | 机甲杯 / 自定义控制器主控 / Robo Pioneers / @LC 2025/3/11 | ESP32S3-N16R8-22引脚

# Board PCB4
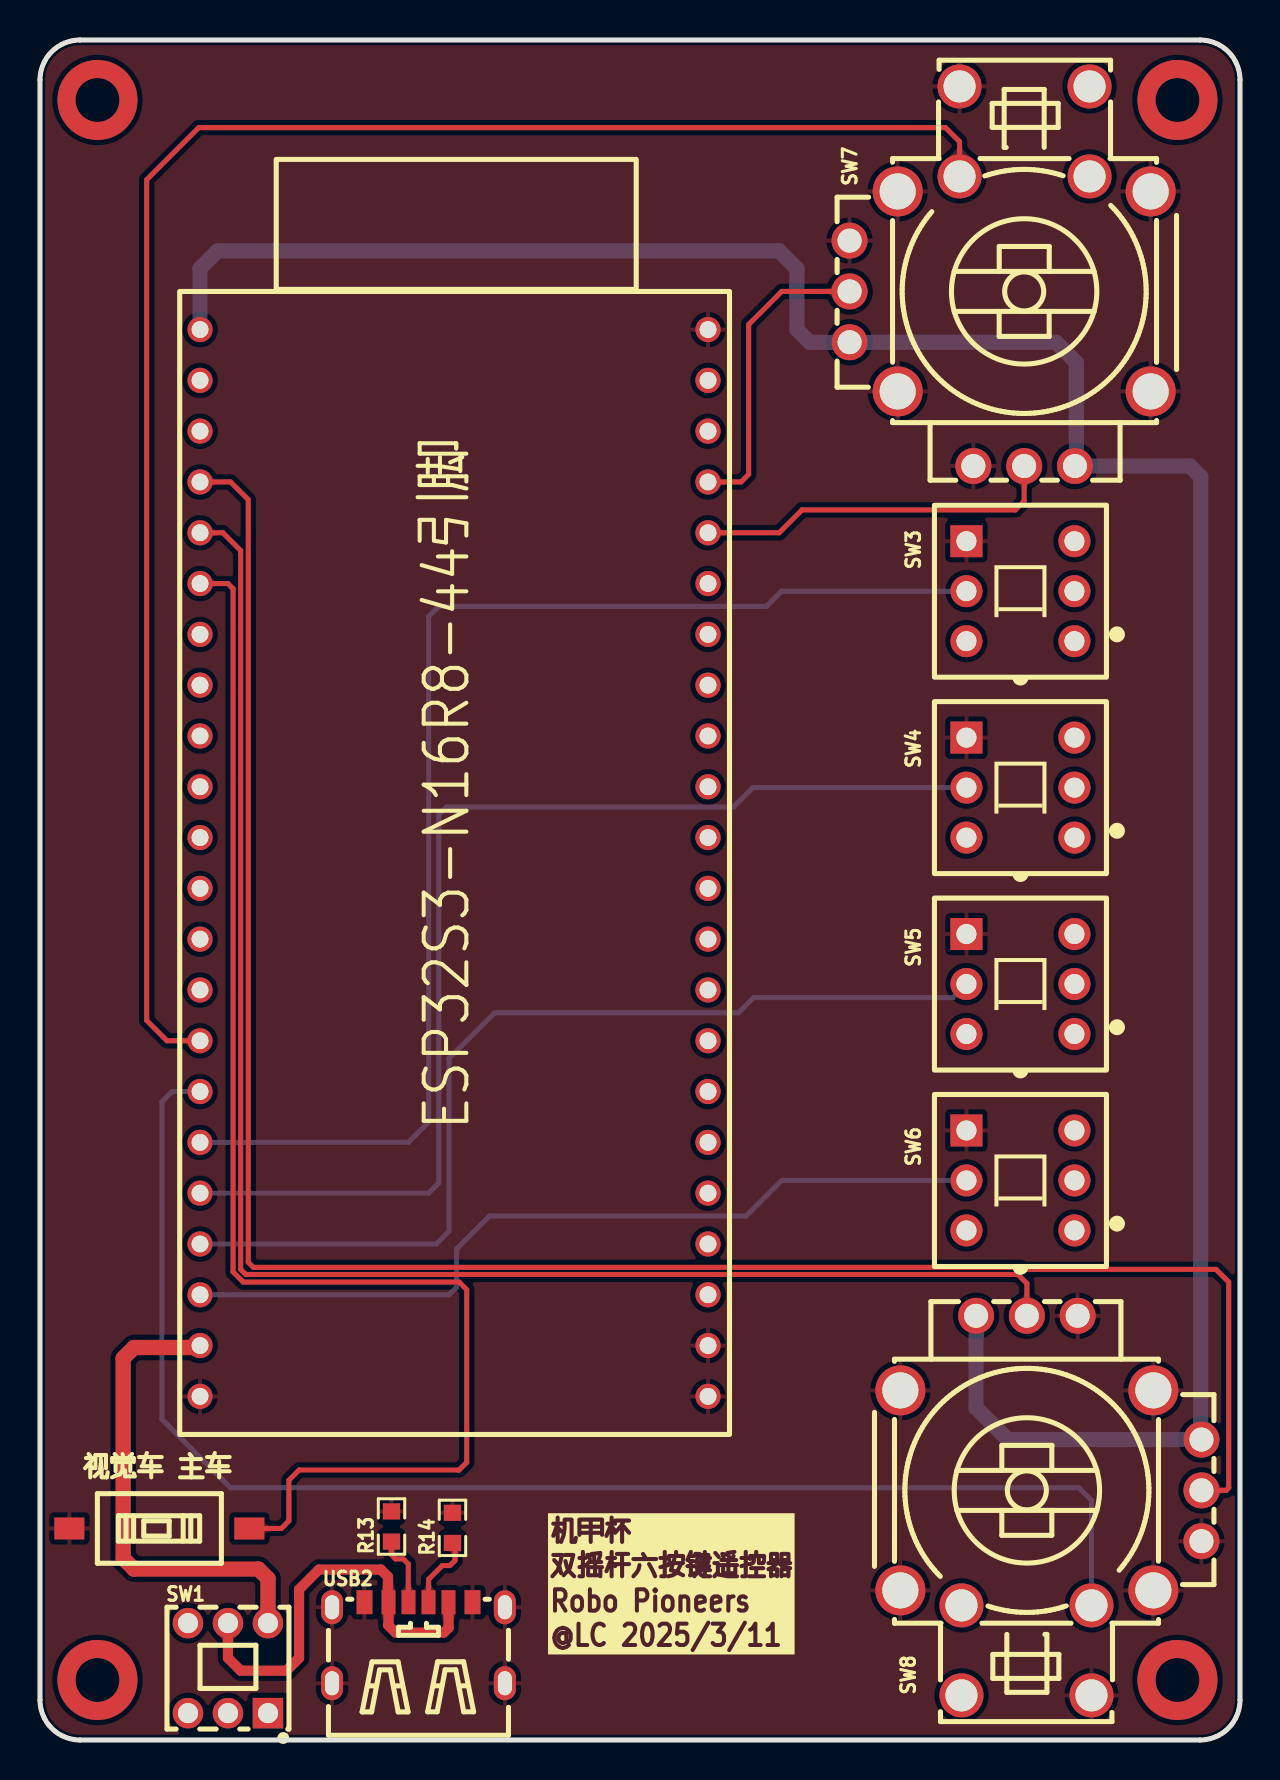
[diagram p10: board, top side]
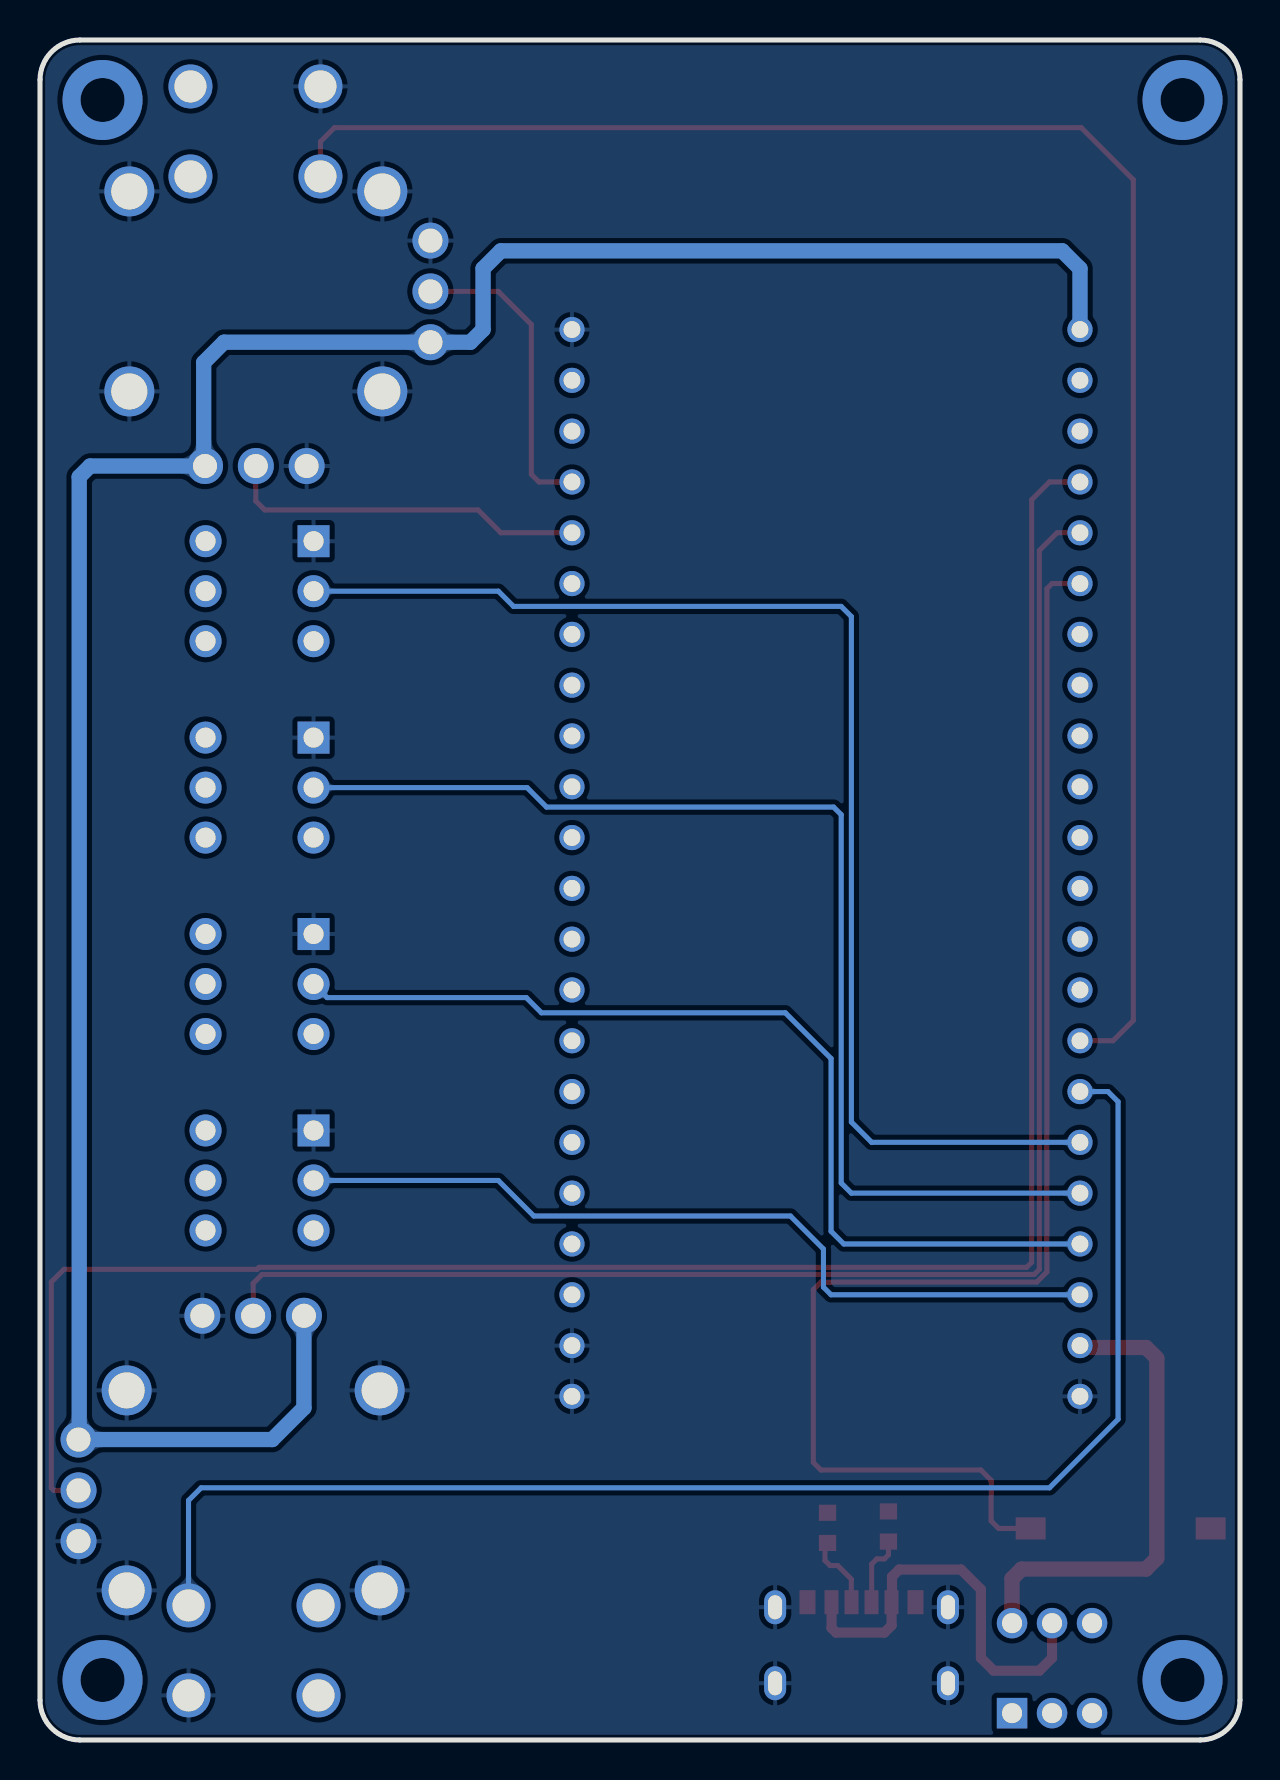
[diagram p11: board, bottom side, seen from below]

Outline 60 x 85 mm; copper layers: Top Layer, Bottom Layer. Coordinates in mm from the lower left corner of the outline.
Outline path: 0,83 0,2 arc(0.59,0.59) 2,0 58,0 arc(59.41,0.59) 60,2 60,83 arc(59.41,84.41) 58,85 2,85 arc(0.59,84.41) 0,83
Stack: Top Layer 0.035mm / Dielectric1 1.51mm FR4 er 4.5 / Bottom Layer 0.035mm

## Design rules (mm)
template: JLCPCB Capability(Two Layers Board)
spacing copperThickness1oz (default): track to track 0.102, other pairs 0.152 to 0.3
spacing copperThickness2oz: track to track 0.203, other pairs 0.152 to 0.3
track width copperThickness1oz (default): min 0.127, default 0.254, max 2.54
track width copperThickness2oz: min 0.203, default 0.254, max 2.54
differential pair differentialPair (default): width min 0.127, default 0.254, max 2.54; gap min 0.152, default 0.152
via viaSize (default): diameter min 0.5, default 0.61, max 10; hole min 0.3, default 0.305, max 6.3

## Placement (name value [footprint] x y rotation side)
R13  5.1kΩ  [R0603]  17.58 10.68 90 top
R14  5.1kΩ  [R0603]  20.62 10.61 90 top
SW1  5.8 ZSGT  [SW-TH_5.8ZSGT]  9.4 3.59 0 top
SW2  DSIC01LS-P  [SW-SMD_2P-L3.5-W6.2-P2.54-LS9.8]  5.97 10.58 180 top
SW3  PB-22E86C  [SW-TH_6P-L8.45-W8.45-P2.50-LS5.5-BL]  49.02 57.44 270 top
SW4  PB-22E86C  [SW-TH_6P-L8.45-W8.45-P2.50-LS5.5-BL]  49.02 47.62 270 top
SW5  PB-22E86C  [SW-TH_6P-L8.45-W8.45-P2.50-LS5.5-BL]  49.02 37.8 270 top
SW6  PB-22E86C  [SW-TH_6P-L8.45-W8.45-P2.50-LS5.5-BL]  49.02 27.98 270 top
SW7  THB001P  [SW-TH_THB001P]  48.01 73.19 180 top
SW8  THB001P  [SW-TH_THB001P]  50.55 11.72 0 top
U2  -  [ESP32S3-R店]  8 17.18 0 top
USB2  TYPE-C 6P(073)  [TYPE-C-SMD_TYPE-C-6P_5]  18.92 4.86 0 top

## Footprints (pads in the part's own frame, mm; a bottom-side part is the same pattern mirrored in y, then rotated)
ESP32S3-R店
  round 1.26 hole 0.84: 1(0,53.34) 2(0,50.8) 3(0,48.26) 4(0,45.72) 5(0,43.18) 6(0,40.64) 7(0,38.1) 8(0,35.56) 9(0,33.02) 10(0,30.48) 11(0,27.94) 12(0,25.4) 13(0,22.86) 14(0,20.32) 15(0,17.78) 16(0,15.24) 17(0,12.7) 18(0,10.16) 19(0,7.62) 20(0,5.08) 21(0,2.54) 22(0,0) 23(25.4,53.34) 24(25.4,50.8) 25(25.4,48.26) 26(25.4,45.72) 27(25.4,43.18) 28(25.4,40.64) 29(25.4,38.1) 30(25.4,35.56) 31(25.4,33.02) 32(25.4,30.48) 33(25.4,27.94) 34(25.4,25.4) 35(25.4,22.86) 36(25.4,20.32) 37(25.4,17.78) 38(25.4,15.24) 39(25.4,12.7) 40(25.4,10.16) 41(25.4,7.62) 42(25.4,5.08) 43(25.4,2.54) 44(25.4,0)
R0603
  rect 0.806x0.864 smd: 1(-0.753,0) 2(0.753,0)
SW-SMD_2P-L3.5-W6.2-P2.54-LS9.8
  rect 1.5x1.1 smd: 1(-4.5,0) 2(4.5,0)
SW-TH_5.8ZSGT
  rect 1.524x1.524 hole 1: 1(2,-2.25)
  round 1.524 hole 1: 2(0,-2.25) 3(-2,-2.25) 4(2,2.25) 5(0,2.25) 6(-2,2.25)
SW-TH_6P-L8.45-W8.45-P2.50-LS5.5-BL
  round 1.6 hole 1: 1(2.5,2.7) 2(0,2.7) 3(-2.5,2.7) 4(2.5,-2.7) 5(0,-2.7)
  rect 1.6x1.6 hole 1: 6(-2.5,-2.7)
SW-TH_THB001P
  round 1.8 hole 1.2: 1(7.527,-1.78) 2(7.527,0.76) 3(7.527,3.3) 4(1.337,9.49) 5(-1.202,9.49) 6(-3.743,9.49)
  round 2.5 hole 1.8: 7(-7.527,5.76) 8(-7.527,-4.24) 9(5.122,-4.24) 10(5.122,5.76)
  round 2.2 hole 1.6: a(-4.472,-4.99) b(2.028,-4.99) c(-4.472,-9.49) d(2.028,-9.49)
TYPE-C-SMD_TYPE-C-6P_5
  oval 1.1x1.7 hole 0.7x1.2: 7(-4.32,1.775) 7(-4.32,-2.025) 7(4.32,1.775) 7(4.32,-2.025)
  rect 0.7x1.2 smd: A5(-0.5,2.025) A9(1.5,2.025) B5(0.5,2.025) B9(-1.5,2.025)
  rect 0.8x1.2 smd: A12(2.7,2.025) B12(-2.7,2.025)

## Nets
As in the schematic.

Pads without a net: SW1 1 2 3 6; SW3 1 2 3 4; SW4 1 2 3 4; SW5 1 2 3 4; SW6 1 2 3 4; SW7 a c; SW8 a c; U2 2 3 7 8 9 10 11 12 13 14 24 25 28 29 30 31 32 33 34 35 36 37 38 39 40 41 42

## Via types
v1: diameter 4, hole 2.2, Top Layer to Bottom Layer, 4 vias

## Routing (per net, layer and track width the routed paths; a pad name or vN(x,y) marks a point on that pad's centre or on a via; arc(x,y) is an arc through that point)
3V3: length 127.7
  Bottom Layer w0.762: 58.07,15.02 48.39,15.02 46.8,16.61 SW8.6 ; 58.07,15.02 58.04,15.06 58.04,63.16 57.5,63.7 SW7.6 51.82,63.77 51.82,68.87 50.8,69.89 SW7.3 40.48,69.89 38.48,69.89 37.85,70.52 37.85,73.57 36.96,74.46 8.89,74.46 8,73.57 U2.1 ; 58.07,15.02 58.07,15.02
+5V: length 24
  Top Layer w0.762: SW1.4 11.4,8.07 10.92,8.55 4.7,8.55 4.16,9.09 4.16,19.09 4.7,19.63 7.91,19.63 U2.21
(no net):
  vias: v1(2.87,82) v1(2.87,3) v1(56.87,82) v1(56.87,3)
K1: length 88.9
  Top Layer w0.254: 45.98,78.18 45.98,79.92 45.28,80.62 7.94,80.62 5.33,78.02 5.33,35.98 6.35,34.96 U2.15
K2: length 71.4
  Bottom Layer w0.254: SW8.b 52.57,11.98 51.94,12.61 9.52,12.61 6.1,16.04 6.1,31.91 6.6,32.42 U2.16
KEY1: length 64.5
  Bottom Layer w0.254: SW3.5 37.08,57.44 36.32,56.68 19.94,56.68 19.43,56.17 19.43,30.9 18.42,29.88 U2.17
KEY2: length 57.5
  Bottom Layer w0.254: SW4.5 35.64,47.62 34.67,46.65 20.32,46.65 19.94,46.27 19.94,27.85 19.43,27.34 U2.18
KEY3: length 48.8
  Bottom Layer w0.254: SW5.5 45.64,37.12 35.69,37.12 34.92,36.36 22.73,36.36 20.45,34.07 20.45,25.44 19.81,24.8 U2.19
KEY4: length 41.8
  Bottom Layer w0.254: U2.20 20.45,22.26 20.83,22.64 20.83,24.55 22.48,26.2 35.31,26.2 37.08,27.98 SW6.5
MODE: length 70
  Top Layer w0.254: SW2.1 12.07,10.58 12.45,10.96 12.45,12.99 12.95,13.5 20.95,13.5 21.34,13.88 21.34,22.52 20.95,22.9 10.16,22.9 9.65,23.41 9.65,57.57 9.4,57.82 U2.6
X1: length 15.4
  Top Layer w0.254: SW7.2 37.09,72.43 35.43,70.78 35.43,63.28 35.05,62.9 U2.26
X2: length 102
  Top Layer w0.254: U2.4 9.52,62.9 10.41,62.01 10.41,23.89 10.67,23.63 49.04,23.63 49.14,23.53 58.8,23.53 59.44,22.9 59.44,12.61 59.31,12.48 SW8.2
Y1: length 18.2
  Top Layer w0.254: U2.27 36.96,60.36 38.1,61.5 48.77,61.5 49.21,61.95 SW7.5
Y2: length 79.6
  Top Layer w0.254: SW8.5 49.34,22.83 48.89,23.28 10.29,23.28 10.03,23.53 10.03,59.47 9.14,60.36 U2.5
$1N655: length 3.6
  Top Layer w0.254: USB2.A5 18.42,6.9 18.42,8.8 18.16,9.05 17.78,9.05 17.58,9.26 R13.1
$1N656: length 3.6
  Top Layer w0.254: USB2.B5 19.43,6.9 19.43,8.04 20.12,8.72 20.5,8.72 20.75,8.98 20.75,9.73
$1N657: length 21.2
  Top Layer w0.508: USB2.A9 20.42,5.6 20.19,5.37 17.78,5.37 17.42,5.73 17.42,5.73 USB2.B9 17.4,6.91 17.4,8.16 17.04,8.52 13.95,8.52 12.95,7.53 12.95,4.1 12.32,3.47 10.03,3.47 9.4,4.1 SW1.5

## Copper pours and planes (outline as drawn; the poured copper is in the pictures)
GND on Top Layer: -13.46,102.15 67.56,102.15 67.56,-12.03 -13.46,-12.03
GND on Bottom Layer: -3.56,91.98 62.74,91.98 62.74,-20.41 -3.56,-20.41

Small or netless copper shapes (teardrops, artwork), in the pictures only: 22 on Top Layer, 18 on Bottom Layer

## Text on the board
Top Silkscreen Layer: 视觉车 主车 | 机甲杯 / 双摇杆六按键遥控器 / Robo Pioneers / @LC 2025/3/11 | ESP32S3-N16R8-44引脚
